# Altium project Monitoring System_V1.0.PrjPcb
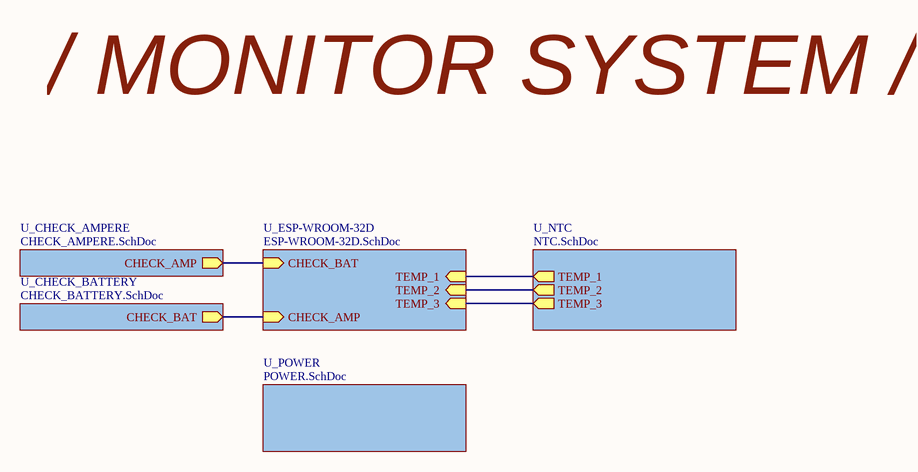
[diagram p0: Monitoring System_V1.0.SchDoc]
6 sheets, 47 parts. Net scope: hierarchical (ports join the sheet entries above them; power ports are global).
Board file: Monitoring System_V1.0.PcbDoc
Sheets:
  Monitoring System_V1.0.SchDoc
    U_CHECK_AMPERE = CHECK_AMPERE.SchDoc
    U_CHECK_BATTERY = CHECK_BATTERY.SchDoc
    U_ESP-WROOM-32D = ESP-WROOM-32D.SchDoc
    U_NTC = NTC.SchDoc
    U_POWER = POWER.SchDoc

## Sheet Monitoring System_V1.0.SchDoc
size A; SheetNumber: 1; SheetTotal: 6

### Sub-sheets
U_CHECK_AMPERE = CHECK_AMPERE.SchDoc: CHECK_AMP (out)
U_CHECK_BATTERY = CHECK_BATTERY.SchDoc: CHECK_BAT (out)
U_ESP-WROOM-32D = ESP-WROOM-32D.SchDoc: CHECK_BAT (in), CHECK_AMP (in), TEMP_1 (in), TEMP_2 (in), TEMP_3 (in)
U_NTC = NTC.SchDoc: TEMP_1 (out), TEMP_2 (out), TEMP_3 (out)
U_POWER = POWER.SchDoc: no entries

### Nets
NetC12_1: sheet U_CHECK_AMPERE/CHECK_AMP, sheet U_ESP-WROOM-32D/CHECK_BAT
NetC15_2: sheet U_CHECK_BATTERY/CHECK_BAT, sheet U_ESP-WROOM-32D/CHECK_AMP
NetC16_1: sheet U_ESP-WROOM-32D/TEMP_1, sheet U_NTC/TEMP_1
NetC17_1: sheet U_ESP-WROOM-32D/TEMP_2, sheet U_NTC/TEMP_2
NetC18_1: sheet U_ESP-WROOM-32D/TEMP_3, sheet U_NTC/TEMP_3

### Notes on the sheet
- / MONITOR SYSTEM /

## Sheet CHECK_AMPERE.SchDoc
size A4; SheetNumber: 4; SheetTotal: 6
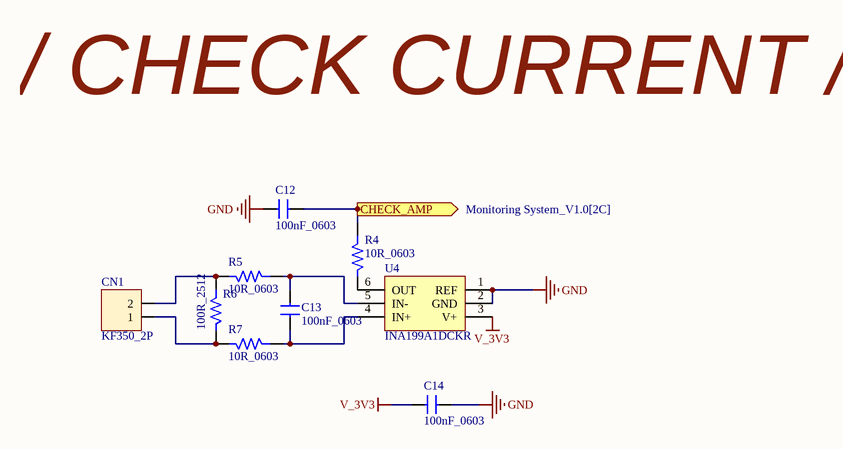
[diagram p1: CHECK_AMPERE.SchDoc]

### Parts
C12  100nF_0603  [CN-SMD-0603]
C13  100nF_0603  [CN-SMD-0603]
C14  100nF_0603  [CN-SMD-0603]
CN1  KF350_2P  [KF350-2P]
R4  10R_0603  [RES-SMD-0603]
R5  10R_0603  [RES-SMD-0603]
R6  100R_2512  [RES-SMD-2512]
R7  10R_0603  [RES-SMD-0603]
U4  INA199A1DCKR  [SC70-6]

### Ports
CHECK_AMP (out, see Monitoring System_V1.0[2C])

### Nets
GND: C12.2 C14.1 U4.1(REF) U4.2(GND)
V_3V3: C14.2 U4.3(V+)
NetC12_1: C12.1 R4.2 ; port CHECK_AMP
NetC13_1: C13.1 R7.2 U4.4(IN+)
NetC13_2: C13.2 R5.2 U4.5(IN-)
NetCN1_1: CN1.1 R6.1 R7.1
NetCN1_2: CN1.2 R5.1 R6.2
NetR4_1: R4.1 U4.6(OUT)

### Notes on the sheet
- / CHECK CURRENT /

### Library data of the parts
C12-C14 = CAP 0603 104: Cap SMD, 0.06x0.03 inch, 1.55x0.85 mm - 1608
CN1 = KF350_2P: Terminal Block 3.5mm
R4 R5 R7 = RES 0603 10R: Resistor SMD, 0.06x0.03 inch, 1.55x0.85 mm - 1608, 1/10W
R6 = RES 2512 100R: Resistor SMD, 0.25x0.12 inch, 6.3x3.2 mm - 6332, 1W
U4 = INA199A1DCKR: INA199 26-V, Bidirectional, Zero-Drift, Low- or High-Side, / Voltage-Output, Current-Shunt Monitor

## Sheet CHECK_BATTERY.SchDoc
size A4; SheetNumber: 5; SheetTotal: 6
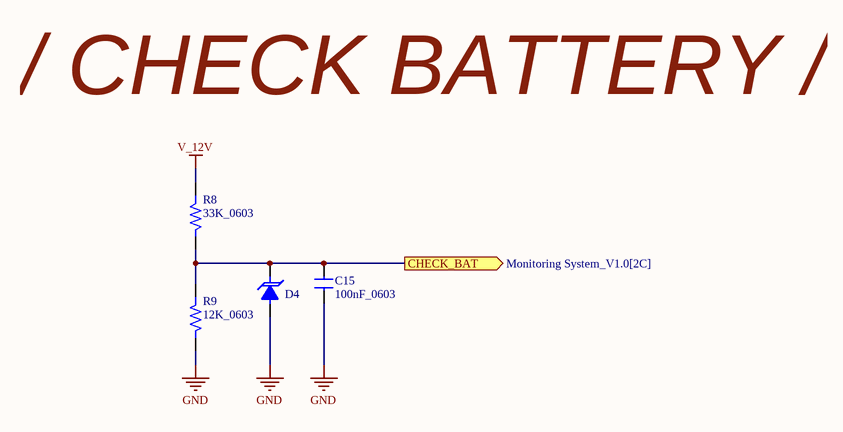
[diagram p2: CHECK_BATTERY.SchDoc]

### Parts
C15  100nF_0603  [CN-SMD-0603]
D4  SMBJ5.0A_KE  [SMB]  (value not drawn)
R8  33K_0603  [RES-SMD-0603]
R9  12K_0603  [RES-SMD-0603]

### Ports
CHECK_BAT (out, see Monitoring System_V1.0[2C])

### Nets
GND: C15.1 D4.1(A) R9.1
V_12V: R8.2
NetC15_2: C15.2 D4.2(K) R8.1 R9.2 ; port CHECK_BAT

### Notes on the sheet
- / CHECK BATTERY /

### Library data of the parts
C15 = CAP 0603 104: as C12 on sheet CHECK_AMPERE
D4 = Diode SMBJ5.0A: TVS Diode, Vrrm =5.0V, Vcl = 9.2V; Code - JEDEC: DO-214-AB; Value: 1N5007; Published: 8-Jun-2000; Revision: July-2002: Re-released for DXP Platform.; Publisher: Altium Limited
R8 = RES 0603 33K: Resistor SMD, 0.06x0.03 inch, 1.55x0.85 mm - 1608, 1/10W
R9 = RES 0603 12K: Resistor SMD, 0.06x0.03 inch, 1.55x0.85 mm - 1608, 1/10W

## Sheet ESP-WROOM-32D.SchDoc
size A4; SheetNumber: 3; SheetTotal: 6
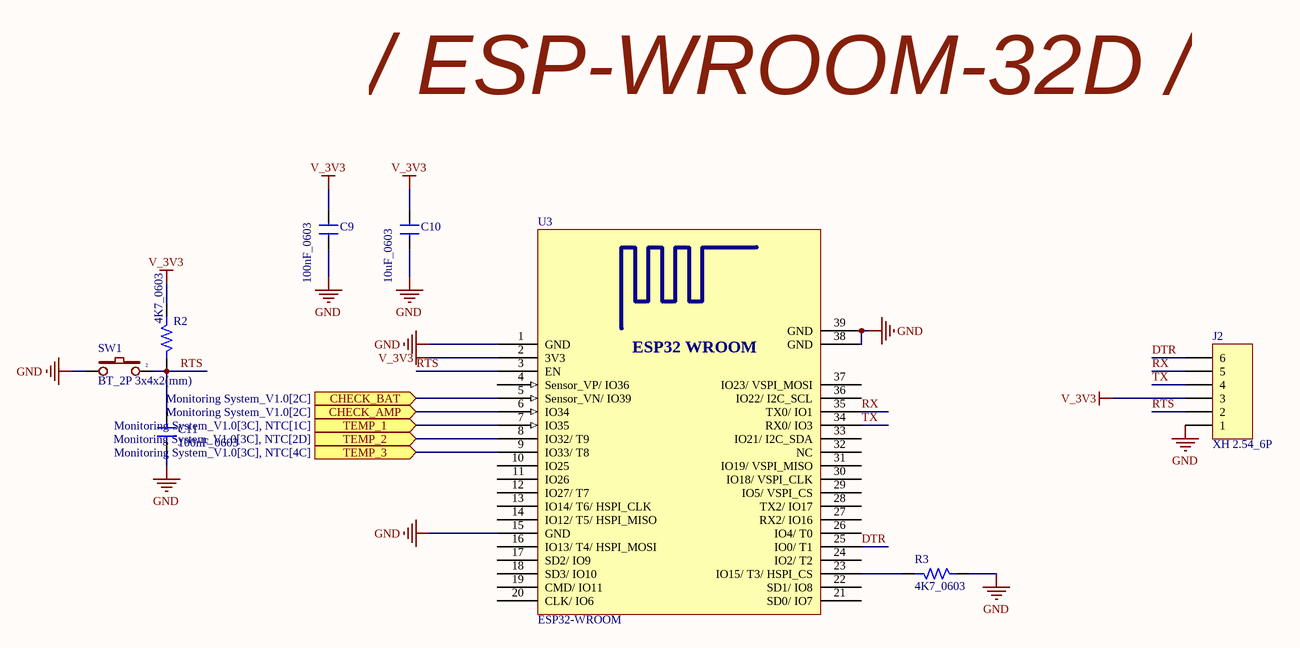
[diagram p3: ESP-WROOM-32D.SchDoc]

### Parts
C9  100nF_0603  [CN-SMD-0603]
C10  10uF_0603  [CN-SMD-0603]
C11  100nF_0603  [CN-SMD-0603]
J2  XH 2.54_6P  [JP6_Boot]
R2  4K7_0603  [RES-SMD-0603]
R3  4K7_0603  [RES-SMD-0603]
SW1  BT_2P 3x4x2(mm)  [BUTTON 2P 3X4X2MM]
U3  ESP32-WROOM  [ESP32 WROOM]

### Ports
CHECK_AMP (in, see Monitoring System_V1.0[2C]), CHECK_BAT (in, see Monitoring System_V1.0[2C]), TEMP_1 (in, see Monitoring System_V1.0[3C], NTC[1C]), TEMP_2 (in, see Monitoring System_V1.0[3C], NTC[2D]), TEMP_3 (in, see Monitoring System_V1.0[3C], NTC[4C])

### Nets
GND: C9.1 C10.1 C11.2 J2.1 R3.1 SW1.1 U3.1(GND) U3.15(GND) U3.38(GND) U3.39(GND)
V_3V3: C9.2 C10.2 J2.3 R2.2 U3.2(3V3)
DTR: J2.6 U3.25(IO0/_T1)
RTS: C11.1 J2.2 R2.1 SW1.2 U3.3(EN)
RX: J2.5 U3.35(TX0/_IO1)
TX: J2.4 U3.34(RX0/_IO3)
NetC12_1: U3.5(Sensor_VN/_IO39) ; port CHECK_BAT
NetC15_2: U3.6(IO34) ; port CHECK_AMP
NetC16_1: U3.7(IO35) ; port TEMP_1
NetC17_1: U3.8(IO32/_T9) ; port TEMP_2
NetC18_1: U3.9(IO33/_T8) ; port TEMP_3
NetR3_2: R3.2 U3.23(IO15/_T3/_HSPI_CS)

Not connected (* = marked no-connect by the designer): U3 4(Sensor_VP/_IO36) 10(IO25) 11(IO26) 12(IO27/_T7) 13(IO14/_T6/_HSPI_CLK) 14(IO12/_T5/_HSPI_MISO) 16(IO13/_T4/_HSPI_MOSI) 17(SD2/_IO9) 18(SD3/_IO10) 19(CMD/_IO11) 20(CLK/_IO6) 21(SD0/_IO7) 22(SD1/_IO8) 24(IO2/_T2) 26(IO4/_T0) 27(RX2/_IO16) 28(TX2/_IO17) 29(IO5/_VSPI_CS) 30(IO18/_VSPI_CLK) 31(IO19/_VSPI_MISO) 32(NC) 33(IO21/_I2C_SDA) 36(IO22/_I2C_SCL) 37(IO23/_VSPI_MOSI)

### Notes on the sheet
- / ESP-WROOM-32D /
- (in symbol ESP32-WROOM) ESP32 WROOM

### Library data of the parts
C9 C11 = CAP 0603 104: as C12 on sheet CHECK_AMPERE
C10 = CAP 0603 106: Cap SMD, 0.06x0.03 inch, 1.55x0.85 mm - 1608
J2 = XH 2.54_6P_Boot
R2 R3 = RES 0603 4K7: Resistor SMD, 0.06x0.03 inch, 1.55x0.85 mm - 1608, 1/10W
SW1 = BT_2P 3x4x2(mm): Switch button 2 pin; Value: SW chip 2 pin
U3 = ESP32-WROOM: ESP32 WROOM, 3.0 V ~ 3.6 V, 80mA.

## Sheet NTC.SchDoc
size A4; SheetNumber: 6; SheetTotal: 6
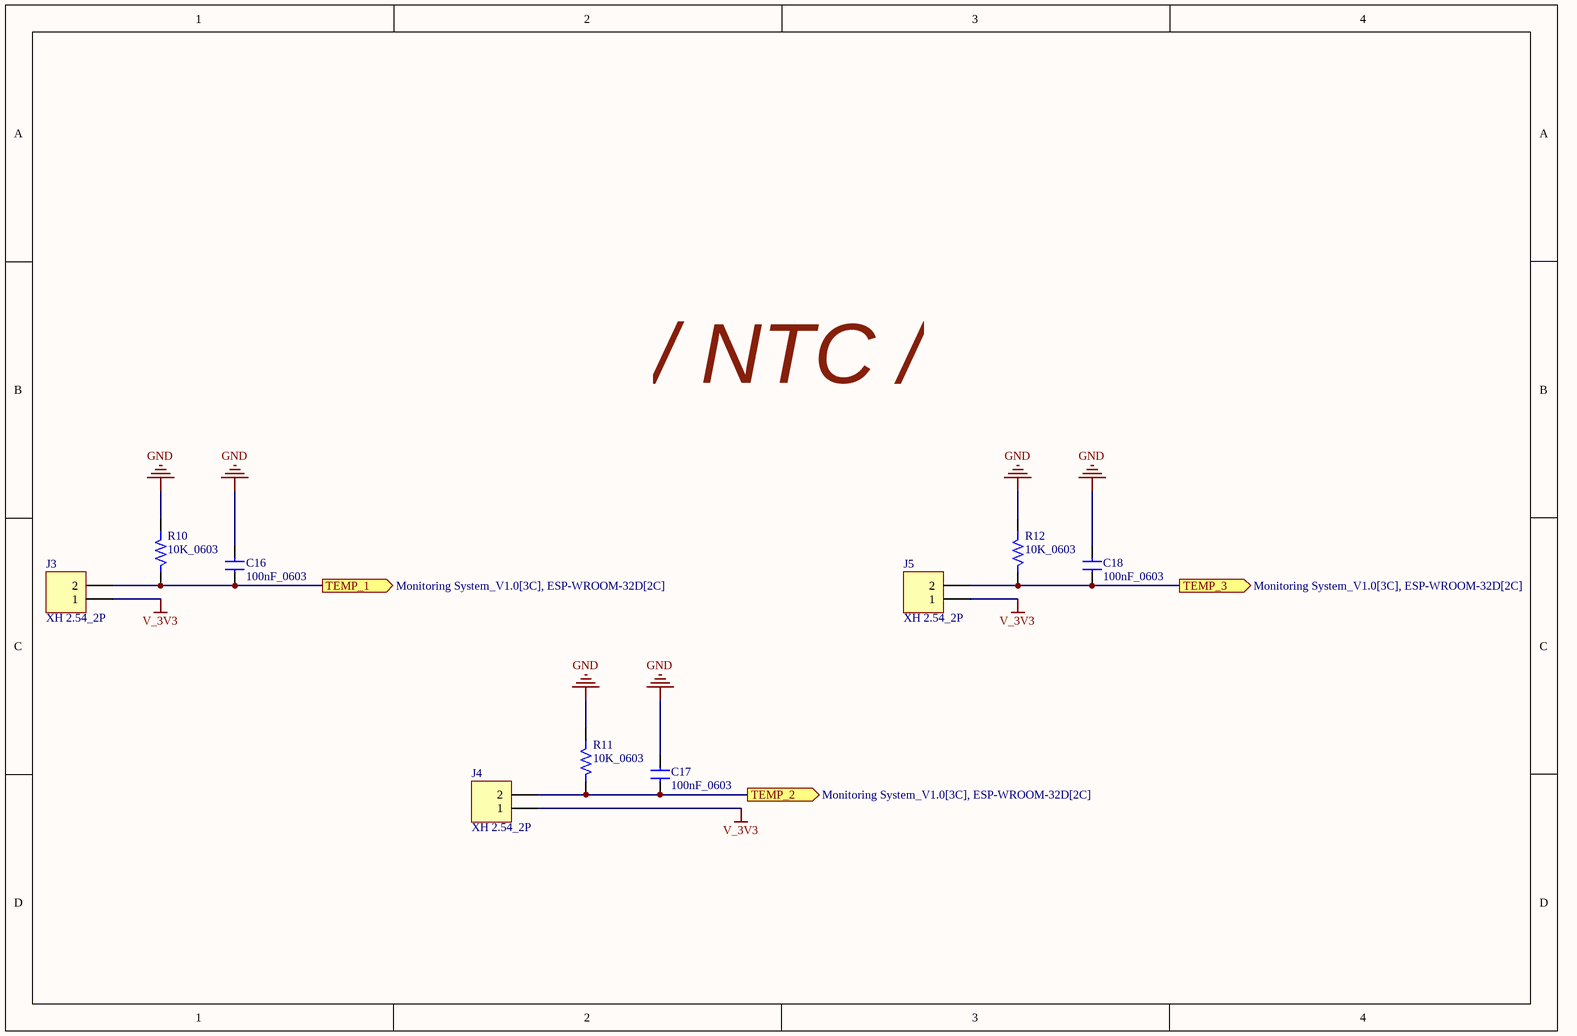
[diagram p4: NTC.SchDoc]

### Parts
C16  100nF_0603  [CN-SMD-0603]
C17  100nF_0603  [CN-SMD-0603]
C18  100nF_0603  [CN-SMD-0603]
J3  XH 2.54_2P  [Header2]
J4  XH 2.54_2P  [Header2]
J5  XH 2.54_2P  [Header2]
R10  10K_0603  [RES-SMD-0603]
R11  10K_0603  [RES-SMD-0603]
R12  10K_0603  [RES-SMD-0603]

### Ports
TEMP_1 (out, see Monitoring System_V1.0[3C], ESP-WROOM-32D[2C]), TEMP_2 (out, see Monitoring System_V1.0[3C], ESP-WROOM-32D[2C]), TEMP_3 (out, see Monitoring System_V1.0[3C], ESP-WROOM-32D[2C])

### Nets
GND: C16.2 C17.2 C18.2 R10.2 R11.2 R12.2
V_3V3: J3.1 J4.1 J5.1
NetC16_1: C16.1 J3.2 R10.1 ; port TEMP_1
NetC17_1: C17.1 J4.2 R11.1 ; port TEMP_2
NetC18_1: C18.1 J5.2 R12.1 ; port TEMP_3

### Notes on the sheet
- / NTC /

### Library data of the parts
C16-C18 = CAP 0603 104: as C12 on sheet CHECK_AMPERE
R10-R12 = RES 0603 10K: Resistor SMD, 0.06x0.03 inch, 1.55x0.85 mm - 1608, 1/10W

## Sheet POWER.SchDoc
size A4; SheetNumber: 2; SheetTotal: 6
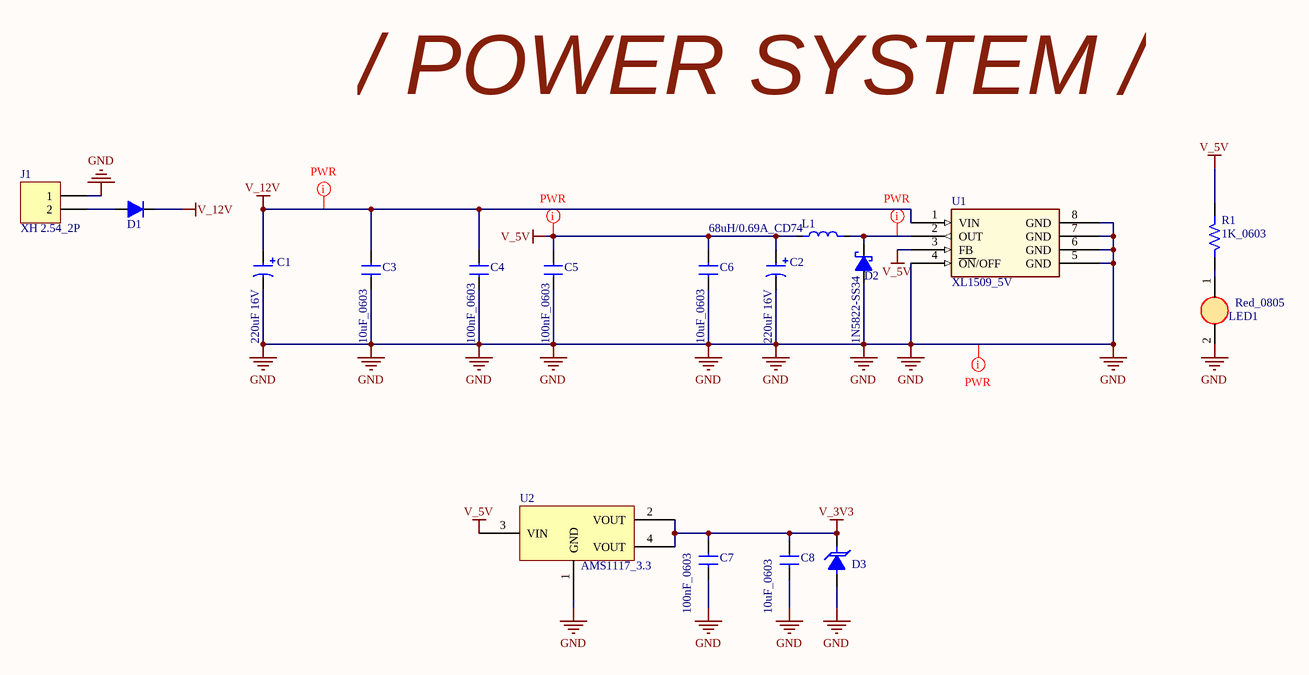
[diagram p5: POWER.SchDoc]

### Parts
C1  220uF 16V  [CAP-ALU-SMD-6.3x7.7]
C2  220uF 16V  [CAP-ALU-SMD-6.3x7.7]
C3  10uF_0603  [CN-SMD-0603]
C4  100nF_0603  [CN-SMD-0603]
C5  100nF_0603  [CN-SMD-0603]
C6  10uF_0603  [CN-SMD-0603]
C7  100nF_0603  [CN-SMD-0603]
C8  10uF_0603  [CN-SMD-0603]
D1  1N5408-S3M  [SMA]  (value not drawn)
D2  1N5822-SS34  [SMA]
D3  SMBJ5.0A_KE  [SMB]  (value not drawn)
J1  XH 2.54_2P  [Header2]
L1  68uH/0.69A_CD74  [INDUCTOR_CD74]
LED1  Red_0805  [LED-0805-Red]
R1  1K_0603  [RES-SMD-0603]
U1  XL1509_5V  [SO8]
U2  AMS1117_3.3  [SOT223-4N]

### Nets
GND: C1.2 C2.2 C3.1 C4.1 C5.1 C6.1 C7.1 C8.1 D2.1(A) D3.1(A) J1.1 LED1.2(K) U1.4(~{ON}/OFF) U1.5(GND) U1.6(GND) U1.7(GND) U1.8(GND) U2.1(GND)
V_3V3: C7.2 C8.2 D3.2(K) U2.2(VOUT) U2.4(VOUT)
V_5V: C2.1 C5.2 C6.2 L1.1 R1.2 U1.3(FB) U2.3(VIN)
V_12V: C1.1 C3.2 C4.2 D1.2(K) U1.1(VIN)
NetD1_1: D1.1(A) J1.2
NetD2_2: D2.2(K) L1.2 U1.2(OUT)
NetLED1_1: LED1.1(A) R1.1

### Layout directives
net class PWR: GND, NetD2_2, V_5V, V_12V

### Notes on the sheet
- / POWER SYSTEM /

### Library data of the parts
C1 C2 = CAP ALU 220uF 16V: 6.3 x 7, CAP ALU; Description 1: 10 => 220uF/6,3V/10V - 10uF => 100uF/16V; Description 2: 0,1uF => 33uF/50V - 10uF => 22uF/63V; Description 3: 0,47uF => 10uF/100V
C3 C6 C8 = CAP 0603 106: as C10 on sheet ESP-WROOM-32D
C4 C5 C7 = CAP 0603 104: as C12 on sheet CHECK_AMPERE
D1 = Diode 1N5408 S3M: Power Diode 3A, VRRM ~ 1000V; Code - JEDEC: DO-214-AB; Value: 1N5007; Published: 8-Jun-2000; Revision: July-2002: Re-released for DXP Platform.; Publisher: Altium Limited
D2 = Diode 1N5822 SS34: Schottky diode, 3A, VRRM 40V; Code - JEDEC: DO-214-AB; Value: 1N5007; Published: 8-Jun-2000; Revision: July-2002: Re-released for DXP Platform.; Publisher: Altium Limited
D3 = Diode SMBJ5.0A: as D4 on sheet CHECK_BATTERY; Published: 8-Jun-2000; Revision: July-2002: Re-released for DXP Platform.; Publisher: Altium Limited
L1 = CD74 680: SMD Power Inductor SMD Power Inductor / CDRH74
LED1 = LED 0805 RED: LED SMD
R1 = RES 0603 1K: Resistor SMD, 0.06x0.03 inch, 1.55x0.85 mm - 1608, 1/10W
U2 = AMS1117_SOT223_3V3: AMS1117_SOT223_3V3, 1.4A, Vin = 18V

## Nets that join several sheets
GND: CHECK_AMPERE (C12.2 C14.1 U4.1 U4.2), CHECK_BATTERY (C15.1 D4.1 R9.1), ESP-WROOM-32D (10 pins), NTC (6 pins), POWER (18 pins)
V_3V3: CHECK_AMPERE (C14.2 U4.3), ESP-WROOM-32D (5 pins), NTC (J3.1 J4.1 J5.1), POWER (5 pins)
V_12V: CHECK_BATTERY (R8.2), POWER (5 pins)
NetC12_1: CHECK_AMPERE (C12.1 R4.2), ESP-WROOM-32D (U3.5)
NetC15_2: CHECK_BATTERY (C15.2 D4.2 R8.1 R9.2), ESP-WROOM-32D (U3.6)
NetC16_1: ESP-WROOM-32D (U3.7), NTC (C16.1 J3.2 R10.1)
NetC17_1: ESP-WROOM-32D (U3.8), NTC (C17.1 J4.2 R11.1)
NetC18_1: ESP-WROOM-32D (U3.9), NTC (C18.1 J5.2 R12.1)